# Altium schematic sheet LVDS_Driver.schdoc
size 420 x 297 mm; EDA_Number: ARTIQ; Author: G.Kasprowicz; CompanyName: WUT ISE; DrawnBy: G.Kasprowicz; Organization: WUT ISE; DocumentNumber: 8; SheetNumber: 8; ModifiedBy: -; CheckedDate: -; Title2: M-LVDS transceivers; Designer: G.Kasprowicz; ModifiedDate: -; ProjectName: Sensor Box
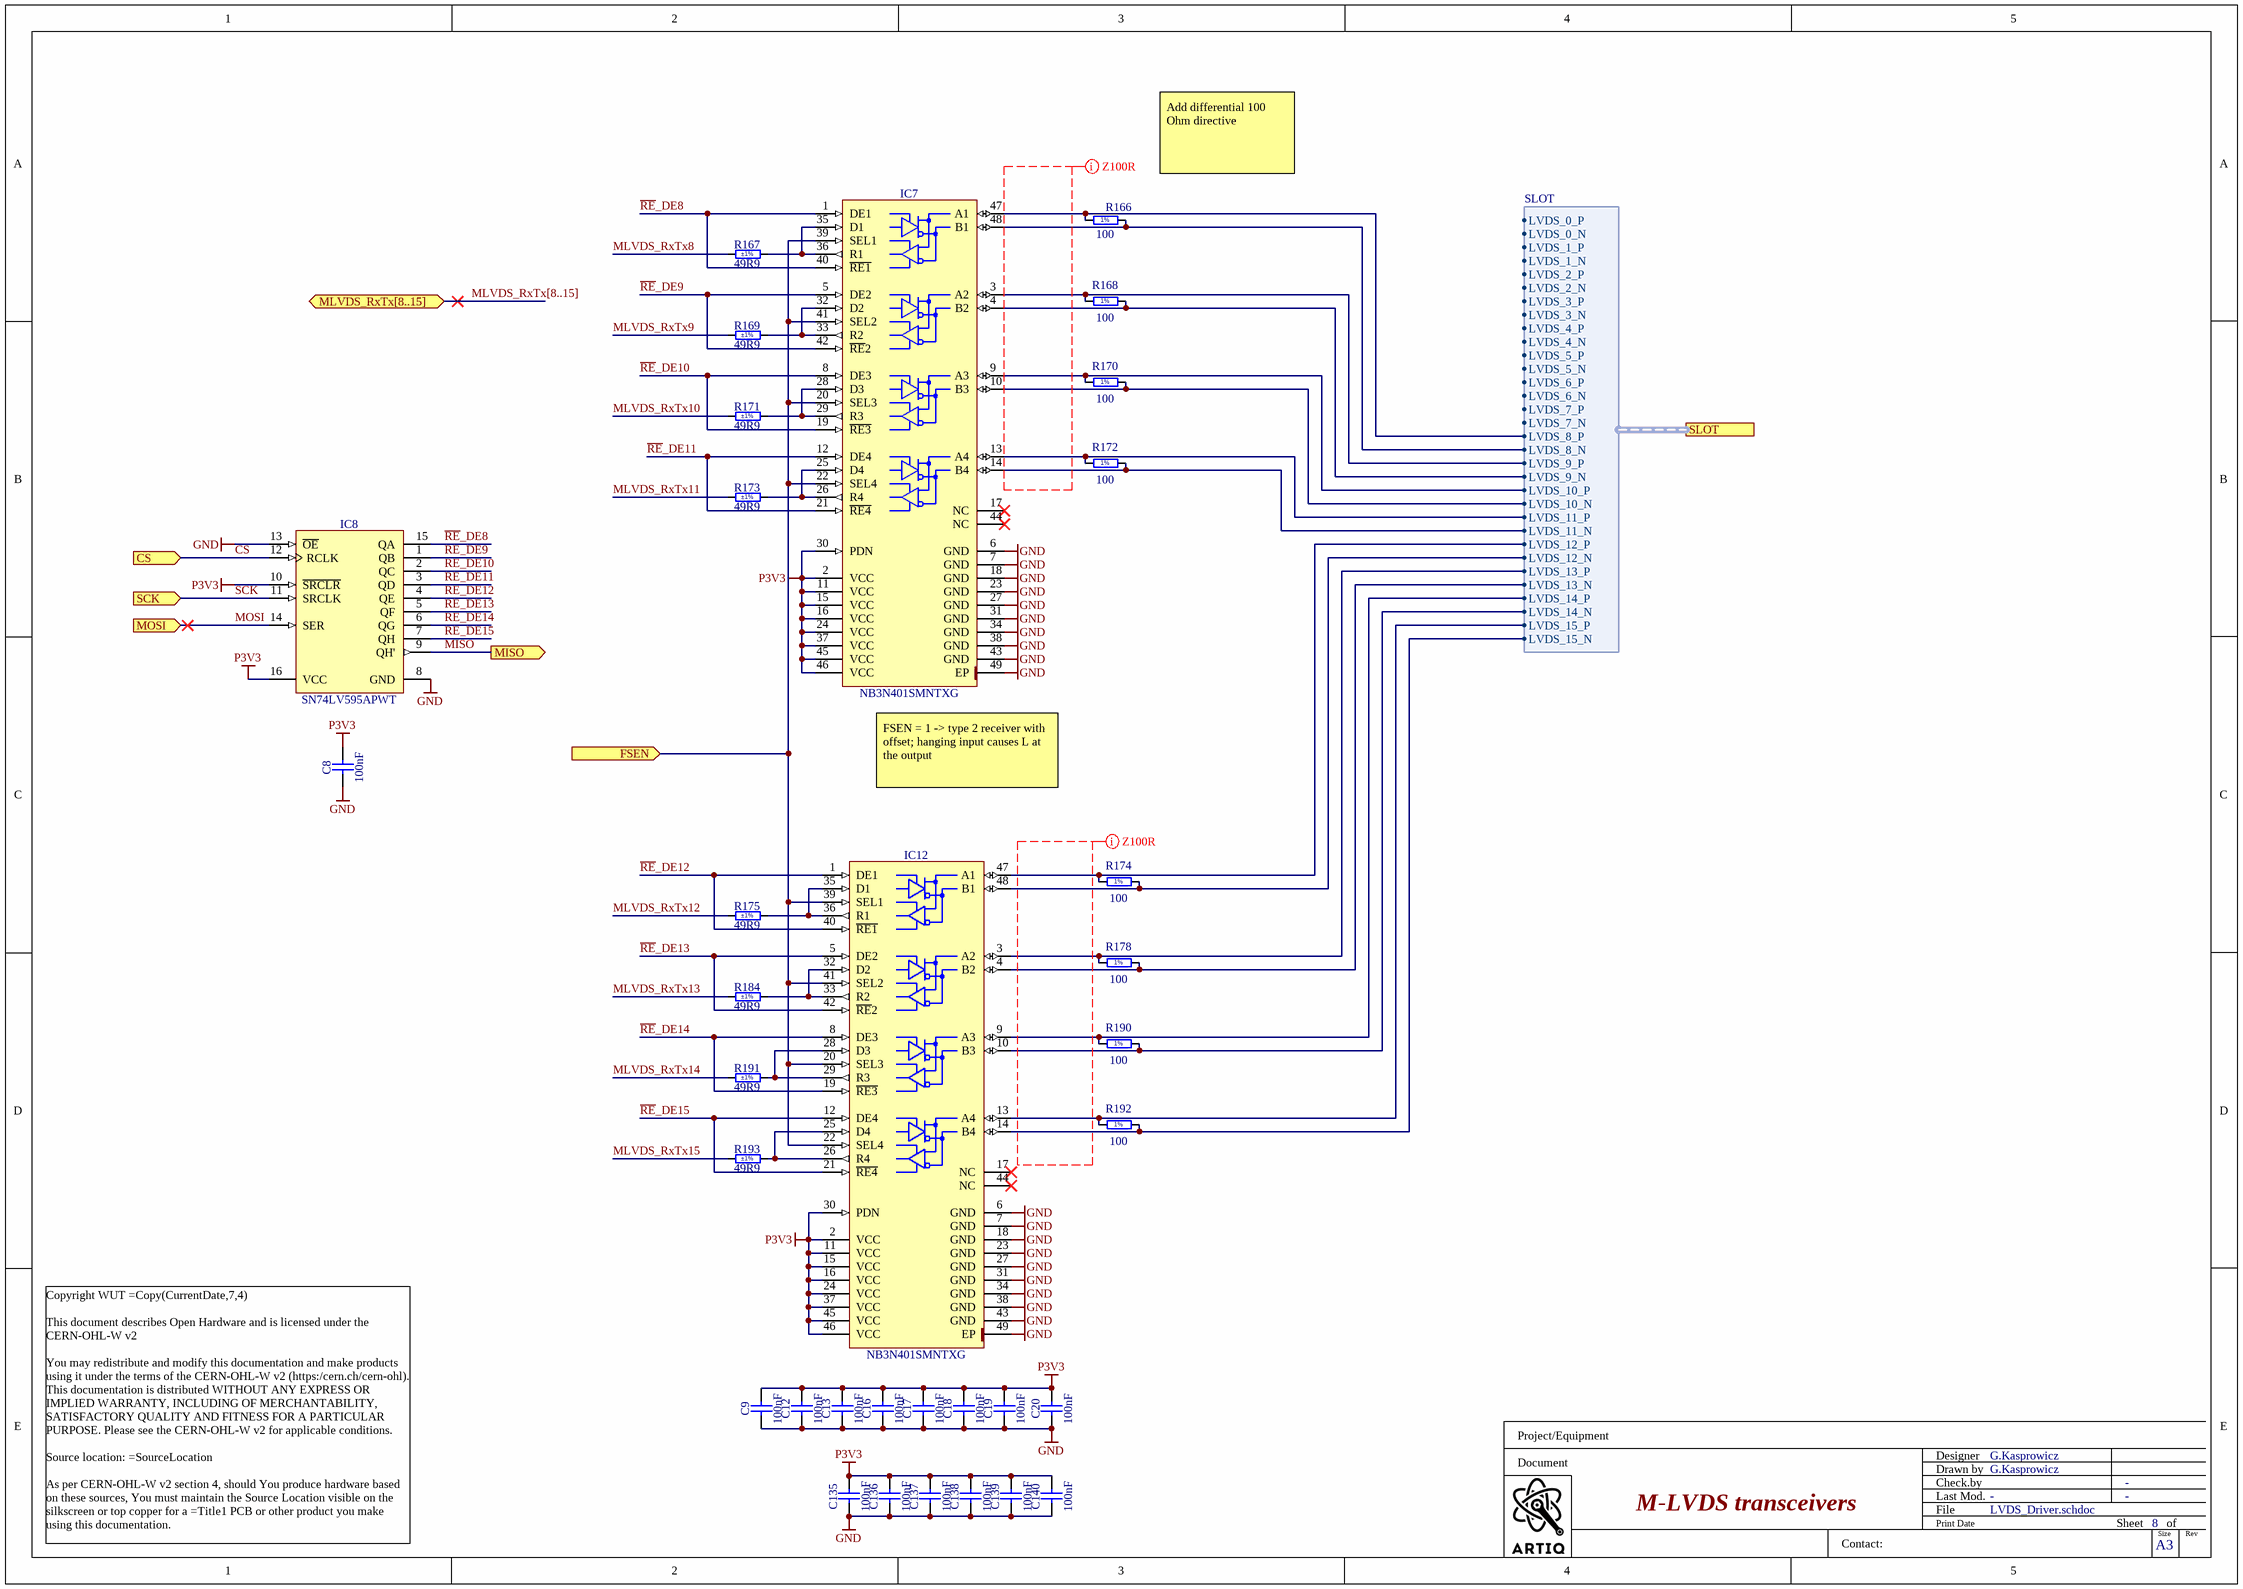
[diagram p0: LVDS_Driver.schdoc]

## Parts
C8  100nF  [CAPC1005X55N]
C9  100nF  [CAPC1005X55N]
C12  100nF  [CAPC1005X55N]
C13  100nF  [CAPC1005X55N]
C16  100nF  [CAPC1005X55N]
C17  100nF  [CAPC1005X55N]
C18  100nF  [CAPC1005X55N]
C19  100nF  [CAPC1005X55N]
C20  100nF  [CAPC1005X55N]
C135  100nF  [CAPC1005X55N]
C136  100nF  [CAPC1005X55N]
C137  100nF  [CAPC1005X55N]
C138  100nF  [CAPC1005X55N]
C139  100nF  [CAPC1005X55N]
C140  100nF  [CAPC1005X55N]
IC7  NB3N401SMNTXG  [QFN50P700X700X100-49N-S420]
IC8  SN74LV595APWT  [SOP65P640X120-16N]
IC12  NB3N401SMNTXG  [QFN50P700X700X100-49N-S420]
R166  100  [RESC1005X40N]
R167  49R9  Tolerance: ±1%  [RESC1005X40N]
R168  100  [RESC1005X40N]
R169  49R9  Tolerance: ±1%  [RESC1005X40N]
R170  100  [RESC1005X40N]
R171  49R9  Tolerance: ±1%  [RESC1005X40N]
R172  100  [RESC1005X40N]
R173  49R9  Tolerance: ±1%  [RESC1005X40N]
R174  100  [RESC1005X40N]
R175  49R9  Tolerance: ±1%  [RESC1005X40N]
R178  100  [RESC1005X40N]
R184  49R9  Tolerance: ±1%  [RESC1005X40N]
R190  100  [RESC1005X40N]
R191  49R9  Tolerance: ±1%  [RESC1005X40N]
R192  100  [RESC1005X40N]
R193  49R9  Tolerance: ±1%  [RESC1005X40N]

## Ports
CS (in), FSEN (in), MISO (out), MLVDS_RxTx[8..15] (bidir), MOSI (in), SCK (in), SLOT (harness SLOT)

## Harnesses
SLOT: LVDS_0_P, LVDS_0_N, LVDS_10_P, LVDS_10_N, LVDS_11_P, LVDS_11_N, LVDS_12_P, LVDS_12_N, LVDS_13_P, LVDS_13_N, LVDS_14_P, LVDS_14_N, LVDS_15_P, LVDS_15_N, LVDS_1_P, LVDS_1_N, LVDS_2_P, LVDS_2_N, LVDS_3_P, LVDS_3_N, LVDS_4_P, LVDS_4_N, LVDS_5_P, LVDS_5_N, LVDS_6_P, LVDS_6_N, LVDS_7_P, LVDS_7_N, LVDS_8_P, LVDS_8_N, LVDS_9_P, LVDS_9_N

## Nets
GND: C8.1 C9.1 C12.1 C13.1 C16.1 C17.1 C18.1 C19.1 C20.1 C135.1 C136.1 C137.1 C138.1 C139.1 C140.1 IC7.6(GND) IC7.7(GND) IC7.18(GND) IC7.23(GND) IC7.27(GND) IC7.31(GND) IC7.34(GND) IC7.38(GND) IC7.43(GND) IC7.49(EP) IC8.8(GND) IC8.13(~{OE}) IC12.6(GND) IC12.7(GND) IC12.18(GND) IC12.23(GND) IC12.27(GND) IC12.31(GND) IC12.34(GND) IC12.38(GND) IC12.43(GND) IC12.49(EP)
P3V3: C8.2 C9.2 C12.2 C13.2 C16.2 C17.2 C18.2 C19.2 C20.2 C135.2 C136.2 C137.2 C138.2 C139.2 C140.2 IC7.2(VCC) IC7.11(VCC) IC7.15(VCC) IC7.16(VCC) IC7.24(VCC) IC7.30(PDN) IC7.37(VCC) IC7.45(VCC) IC7.46(VCC) IC8.10(~{SRCLR}) IC8.16(VCC) IC12.2(VCC) IC12.11(VCC) IC12.15(VCC) IC12.16(VCC) IC12.24(VCC) IC12.30(PDN) IC12.37(VCC) IC12.45(VCC) IC12.46(VCC)
CS: IC8.12(RCLK) ; port CS
FSEN: IC7.20(SEL3) IC7.22(SEL4) IC7.39(SEL1) IC7.41(SEL2) IC12.20(SEL3) IC12.22(SEL4) IC12.39(SEL1) IC12.41(SEL2) ; port FSEN
MISO: IC8.9(QH') ; port MISO
MLVDS_RxTx8: R167.1
MLVDS_RxTx9: R169.1
MLVDS_RxTx10: R171.1
MLVDS_RxTx11: R173.1
MLVDS_RxTx12: R175.1
MLVDS_RxTx13: R184.1
MLVDS_RxTx14: R191.1
MLVDS_RxTx15: R193.1
MOSI: IC8.14(SER) ; port MOSI
~{RE}_DE8: IC7.1(DE1) IC7.40(~{RE1}) IC8.15(QA)
~{RE}_DE9: IC7.5(DE2) IC7.42(~{RE}2) IC8.1(QB)
~{RE}_DE10: IC7.8(DE3) IC7.19(~{RE3}) IC8.2(QC)
~{RE}_DE11: IC7.12(DE4) IC7.21(~{RE4}) IC8.3(QD)
~{RE}_DE12: IC8.4(QE) IC12.1(DE1) IC12.40(~{RE1})
~{RE}_DE13: IC8.5(QF) IC12.5(DE2) IC12.42(~{RE}2)
~{RE}_DE14: IC8.6(QG) IC12.8(DE3) IC12.19(~{RE3})
~{RE}_DE15: IC8.7(QH) IC12.12(DE4) IC12.21(~{RE4})
SCK: IC8.11(SRCLK) ; port SCK
NetIC7_3: IC7.3(A2) R168.1 ; port SLOT.LVDS_9_P
NetIC7_4: IC7.4(B2) R168.2 ; port SLOT.LVDS_9_N
NetIC7_9: IC7.9(A3) R170.1 ; port SLOT.LVDS_10_P
NetIC7_10: IC7.10(B3) R170.2 ; port SLOT.LVDS_10_N
NetIC7_13: IC7.13(A4) R172.1 ; port SLOT.LVDS_11_P
NetIC7_14: IC7.14(B4) R172.2 ; port SLOT.LVDS_11_N
NetIC7_25: IC7.25(D4) IC7.26(R4) R173.2
NetIC7_28: IC7.28(D3) IC7.29(R3) R171.2
NetIC7_32: IC7.32(D2) IC7.33(R2) R169.2
NetIC7_35: IC7.35(D1) IC7.36(R1) R167.2
NetIC7_47: IC7.47(A1) R166.1 ; port SLOT.LVDS_8_P
NetIC7_48: IC7.48(B1) R166.2 ; port SLOT.LVDS_8_N
NetIC12_3: IC12.3(A2) R178.1 ; port SLOT.LVDS_13_P
NetIC12_4: IC12.4(B2) R178.2 ; port SLOT.LVDS_13_N
NetIC12_9: IC12.9(A3) R190.1 ; port SLOT.LVDS_14_P
NetIC12_10: IC12.10(B3) R190.2 ; port SLOT.LVDS_14_N
NetIC12_13: IC12.13(A4) R192.1 ; port SLOT.LVDS_15_P
NetIC12_14: IC12.14(B4) R192.2 ; port SLOT.LVDS_15_N
NetIC12_25: IC12.25(D4) IC12.26(R4) R193.2
NetIC12_28: IC12.28(D3) IC12.29(R3) R191.2
NetIC12_32: IC12.32(D2) IC12.33(R2) R184.2
NetIC12_35: IC12.35(D1) IC12.36(R1) R175.2
NetIC12_47: IC12.47(A1) R174.1 ; port SLOT.LVDS_12_P
NetIC12_48: IC12.48(B1) R174.2 ; port SLOT.LVDS_12_N

Not connected (* = marked no-connect by the designer): IC7 17(NC)* 44(NC)*; IC12 17(NC)* 44(NC)*

## Buses and harness runs
bus MLVDS_RxTx[8..15] = port MLVDS_RxTx[8..15]

## Layout directives
net class Z100R: (no net found under the mark)

## Notes on the sheet
- Add differential 100 Ohm directive
- (near IC7) FSEN = 1 -> type 2 receiver with offset; hanging input causes L at the output
- Project/Equipment
- Document
- Designer
- Drawn by
- Check.by
- Copyright WUT =Copy(CurrentDate,7,4)
  This document describes Open Hardware and is licensed under the CERN-OHL-W v2
  You may redistribute and modify this documentation and make products using it under the terms of the CERN-OHL-W v2 (https:/cern.ch/cern-ohl). This documentation is distributed WITHOUT ANY EXPRESS OR IMPLIED WARRANTY, INCLUDING OF MERCHANTABILITY, SATISFACTORY QUALITY AND FITNESS FOR A PARTICULAR PURPOSE. Please see the CERN-OHL-W v2 for applicable conditions.
  Source location: =SourceLocation
  As per CERN-OHL-W v2 section 4, should You produce hardware based on these sources, You must maintain the Source Location visible on the silkscreen or top copper for a =Title1 PCB or other product you make using this documentation.
- Contact:
- File
- Last Mod.
- Print Date
- Sheet
- Size
- A3
- of
- Rev
- (in symbol R0402_100R_1%_0.1W_100PPM) 1%

## Library data of the parts
C8 C9 C12 C13 C16-C20 C135-C140 = CC0402_100NF_16V_10%_X5R: Non-polarised capacitor; Part Description: SMD Multilayer Chip Ceramic Capacitor; Manufacturer: GENERIC; Manufacturer1 Part Number: GRM155R61C104KA88D; Voltage: 16V; TC: X5R; Tolerance: ±10%; Part Number: CC0402_100NF_16V_10%_X5R; Component Kind: Standard; Component Type: Standard; Pin Count: 2; Value: 100nF; Status: None; Manufacturer Part Number: CC0402_100NF_16V_10%_X5R; Case: 0402; Mounted: Yes; Socket: No; SMD: Yes; Sense: No; Manufacturer1 Example: MURATA; Manufacturer1 ComponentHeight: 0.55mm; HelpURL: \\cern.ch\dfs\Applications\Altium\Datasheets\CC0402_X5R_MURATA_GRM.pdf; Author: CERN DEM JLC; CreateDate: 10.12.2013; LatestRevisionDate: 10.12.2013
IC7 IC12 = NB3N401SMNTXG: 3.3 V Quad Channel Half‐Duplex M-LVDS Driver Receiver; Manufacturer: ON SEMICONDUCTOR; PressFit: No; Bonding: No; Part Number: NB3N401SMNTXG; Component Kind: Standard; Component Type: Standard; Device: NB3N401SMNTXG; PackageDescription: QFN, 0.50mm Pitch, Square; 48 Pin, 7.00mm L X 7.00mm W X 1.00mm H body (w/Thermal Tab 4.20 X 4.20mm), IPC Medium Density; Part Description: 3.3 V Quad Channel Half‐Duplex M-LVDS Driver Receiver; Manufacturer Part Number: NB3N401SMNTXG; Pin Count: 49; Case: QFN48; Mounted: Yes; Socket: No; SMD: Yes; Sense: No; ComponentHeight: 1mm; Author: CERN DEM HF; HelpURL: \\cern.ch\dfs\Applications\Altium\Datasheets\NB3N401SMNTXG.pdf; CreateDate: 18.02.2022; LatestRevisionDate: 18.02.2022
IC8 = SN74LV595APWT: 8-Bit Shift Register With 3-State Output Register; Manufacturer: TEXAS INSTRUMENTS; PressFit: No; Bonding: No; Part Number: SN74LV595APWT; Component Kind: Standard; Component Type: Standard; Device: SN74LV595APWT; PackageDescription: SOP, 0.65mm pitch; 16 pin, 4.40mm W X 5.00mm L X 1.20mm H body IPC Medium Density; Part Description: 8-Bit Shift Register With 3-State Output Register; Manufacturer Part Number: SN74LV595APWT; Pin Count: 16; Case: TSSOP16; Mounted: Yes; Socket: No; SMD: Yes; Sense: No; ComponentHeight: 1.2mm; Author: CERN DEM JLC; HelpURL: \\cern.ch\dfs\Applications\Altium\Datasheets\SN74LV595APWT.pdf; CreateDate: 10.05.2012; LatestRevisionDate: 10.05.2012
R166 R168 R170 R172 R174 R178 R190 R192 = R0402_100R_1%_0.1W_100PPM: Resistor - 1%; Part Description: General Purpose Thick Film Chip Resistor; Manufacturer: GENERIC; Manufacturer Part Number: R0402_100R_1%_0.1W_100PPM_50V; Manufacturer1 Part Number: ERJ2RKF1000X; Power: 0.1W; TC: ±100ppm/°C; Voltage: 50V; Part Number: R0402_100R_1%_0.1W_100PPM; Component Kind: Standard; Component Type: Standard; Pin Count: 2; Value: 100; Status: Not recommended; Tolerance: ±1%; Case: 0402; Mounted: Yes; Sense: No; Socket: No; SMD: Yes; Manufacturer1 Example: PANASONIC; Manufacturer1 ComponentHeight: 0.4mm; HelpURL: \\cern.ch\dfs\Applications\Altium\Datasheets\R0402_PANASONIC_ERJ2RK.pdf; Author: CERN DEM JLC; CreateDate: 12.12.2013; LatestRevisionDate: 03.03.2015
R167 R169 R171 R173 R175 R184 R191 R193 = R0402_49R9_1%_0.0625W_100PPM: Resistor - 1%; Part Description: General Purpose Thick Film Chip Resistor; Manufacturer: GENERIC; Manufacturer1 Part Number: 232270674999L or RC0402FR-0749R9L; TC: ±100ppm/°C; PressFit: No; Part Number: R0402_49R9_1%_0.0625W_100PPM; Component Kind: Standard; Component Type: Standard; Pin Count: 2; Value: 49R9; Status: Not Recommended; Power: 0.0625W; Manufacturer Part Number: R0402_49R9_1%_0.0625W_100PPM; Case: 0402; Mounted: Yes; Sense: No; Socket: No; SMD: Yes; Manufacturer1 Example: YAGEO PHYCOMP; Manufacturer1 ComponentHeight: 0.4mm; HelpURL: \\cern.ch\dfs\Applications\Altium\Datasheets\R0402_Phycomp_RC0402.pdf; Author: CERN DEM JLC; CreateDate: 24.10.2012; LatestRevisionDate: 24.10.2012